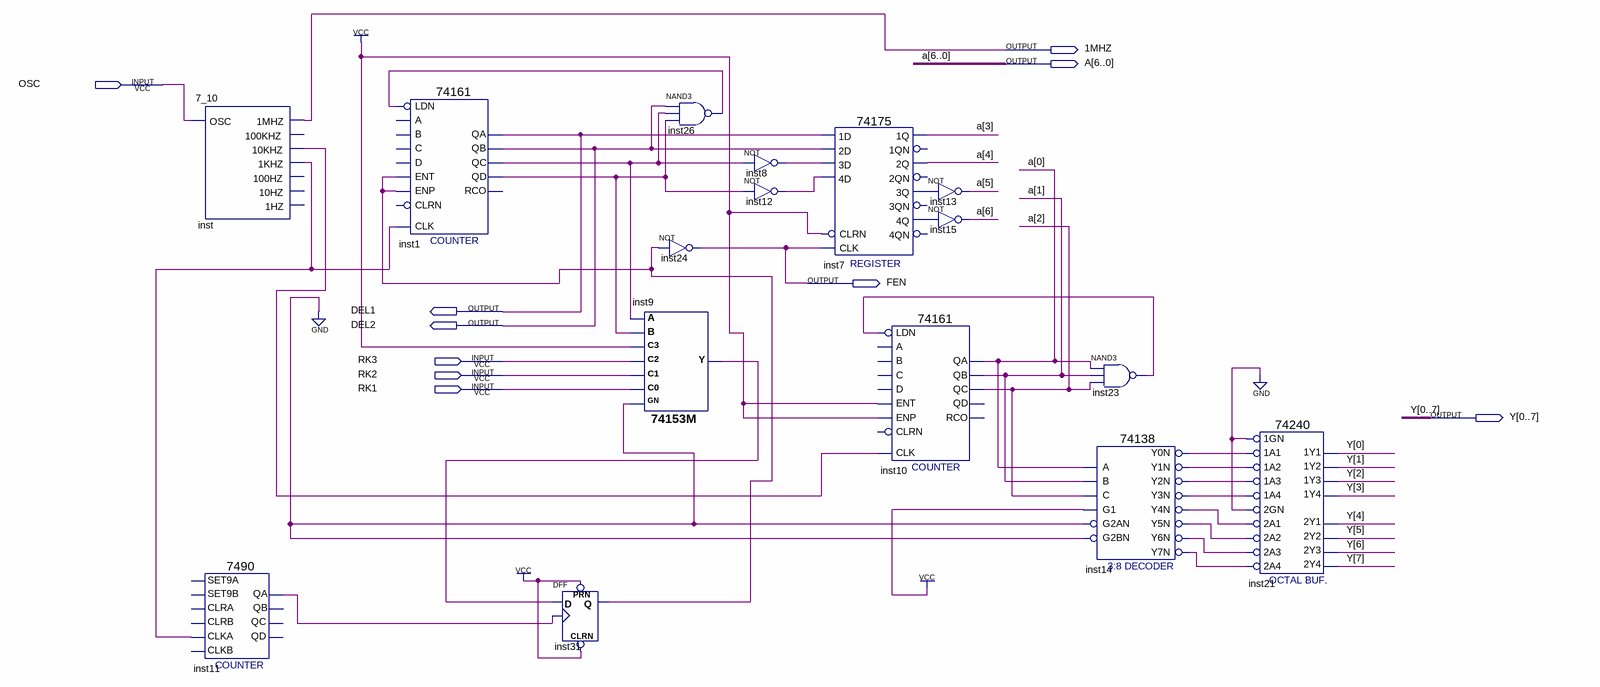
[diagram p0: schematic sheet]
// Quartus schematic BASIC.bdf as structural Verilog: 16 symbols, 10 pins
module BASIC (
  input  OSC,
  input  RK3,
  input  RK2,
  input  RK1,
  output \1MHZ ,
  output [6:0] A,
  output FEN,
  output DEL1,
  output DEL2,
  output [0:7] Y
);

  wire inst1_qc, inst1_qd, inst7_3q, inst7_4q, inst8_out, inst9_y, inst11_qa, inst12_out, inst14_y0n,
       inst14_y1n, inst14_y2n, inst14_y3n, inst14_y4n, inst14_y5n, inst14_y6n, inst14_y7n, inst23_out,
       inst26_out, inst31_q, inst_1khz, inst_10khz;

  \7_10  inst (.OSC(OSC), .\1MHZ (\1MHZ ), .\10KHZ (inst_10khz), .\1KHZ (inst_1khz));  // open: 100KHZ, 100HZ, 10HZ, 1HZ
  \7490  inst11 (.CLKA(inst_1khz), .QA(inst11_qa));  // open: SET9A, CLRA, SET9B, CLKB, CLRB, QD, QB, QC
  \74161  inst1 (
    .CLK(inst_1khz), .ENP(inst31_q), .LDN(inst26_out), .ENT(inst31_q), .QD(inst1_qd), .QC(inst1_qc),
    .QB(DEL2), .QA(DEL1));  // open: CLRN, A, D, B, C, RCO
  DFF inst31 (.CLRN(1'b1), .CLK(inst11_qa), .D(inst9_y), .PRN(1'b1), .Q(inst31_q));
  \74153M  inst9 (.A(inst1_qc), .B(inst1_qd), .C3(1'b1), .C2(RK3), .C1(RK2), .C0(RK1), .GN(1'b0), .Y(inst9_y));
  nand inst26 (inst26_out, DEL2, inst1_qc, inst1_qd);
  not inst24 (FEN, inst31_q);
  not inst8 (inst8_out, inst1_qc);
  not inst12 (inst12_out, inst1_qd);
  \74175  inst7 (
    .CLRN(1'b1), .CLK(FEN), .\3D (inst8_out), .\2D (DEL2), .\1D (DEL1), .\4D (inst12_out), .\1Q (A[3]),
    .\3Q (inst7_3q), .\2Q (A[4]), .\4Q (inst7_4q));  // open: 1QN, 2QN, 4QN, 3QN
  \74161  inst10 (
    .CLK(inst_10khz), .ENP(1'b1), .LDN(inst23_out), .ENT(1'b1), .QC(A[2]), .QB(A[1]), .QA(A[0]));  // open: CLRN, A, D, B, C, QD, RCO
  not inst13 (A[5], inst7_3q);
  not inst15 (A[6], inst7_4q);
  nand inst23 (inst23_out, A[0], A[1], A[2]);
  \74138  inst14 (
    .A(A[0]), .B(A[1]), .G1(1'b1), .C(A[2]), .G2AN(1'b0), .G2BN(1'b0), .Y0N(inst14_y0n), .Y1N(inst14_y1n),
    .Y2N(inst14_y2n), .Y3N(inst14_y3n), .Y4N(inst14_y4n), .Y5N(inst14_y5n), .Y6N(inst14_y6n), .Y7N(inst14_y7n));
  \74240  inst21 (
    .\1A2 (inst14_y1n), .\2A1 (inst14_y4n), .\1A1 (inst14_y0n), .\2GN (1'b0), .\1A4 (inst14_y3n),
    .\2A3 (inst14_y6n), .\2A4 (inst14_y7n), .\1A3 (inst14_y2n), .\1GN (1'b0), .\2A2 (inst14_y5n),
    .\1Y2 (Y[1]), .\1Y3 (Y[2]), .\1Y4 (Y[3]), .\1Y1 (Y[0]), .\2Y3 (Y[6]), .\2Y4 (Y[7]), .\2Y1 (Y[4]),
    .\2Y2 (Y[5]));
endmodule
